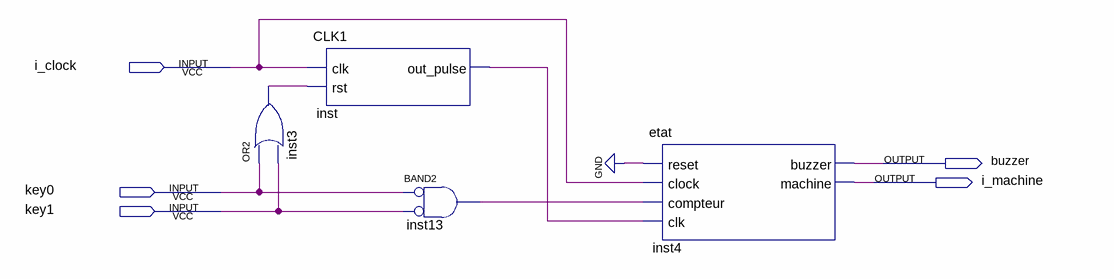
[diagram p0: schematic sheet]
// Quartus schematic urgence.bdf as structural Verilog: 4 symbols, 5 pins
module urgence (
  input  i_clock,
  input  key0,
  input  key1,
  output buzzer,
  output i_machine
);

  wire inst3_out, inst13_out, inst_out_pulse;

  or inst3 (inst3_out, key0, key1);
  CLK1 inst (.clk(i_clock), .rst(inst3_out), .out_pulse(inst_out_pulse));
  and inst13 (inst13_out, ~key0, ~key1);  // BAND2
  etat inst4 (
    .reset(1'b0), .clock(i_clock), .compteur(inst13_out), .clk(inst_out_pulse), .buzzer(buzzer),
    .machine(i_machine));
endmodule
